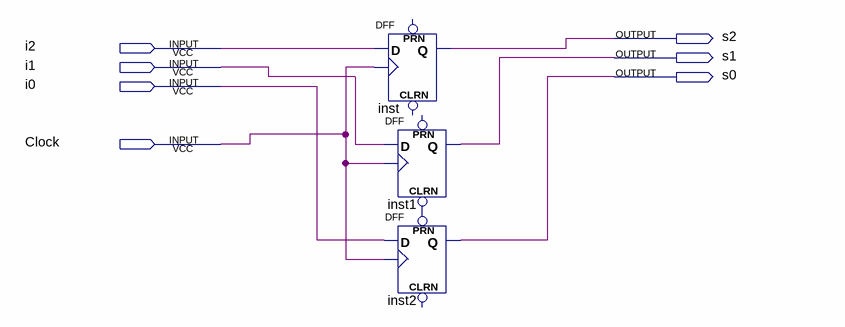
[diagram p0: schematic sheet]
// Quartus schematic Registrador3bits.bdf as structural Verilog: 3 symbols, 7 pins
module Registrador3bits (
  input  i2,
  input  i1,
  input  i0,
  input  Clock,
  output s2,
  output s1,
  output s0
);

  wire undriven;

  DFF inst (.CLK(Clock), .D(i2), .Q(s2));  // open: CLRN, PRN
  DFF inst1 (.CLRN(undriven), .CLK(Clock), .D(i1), .Q(s1));  // open: PRN
  DFF inst2 (.CLK(Clock), .D(i0), .PRN(undriven), .Q(s0));  // open: CLRN
endmodule
